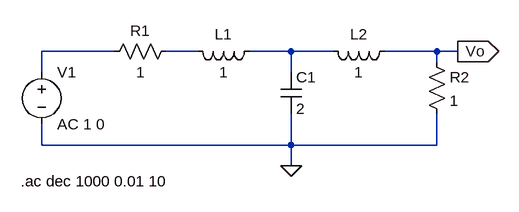
[diagram p0: schematic Ejercicio1.asc]
Ejercicio1.asc, the LTspice schematic file:
Version 4
SHEET 1 880 680
WIRE 16 112 -96 112
WIRE 144 112 96 112
WIRE 288 112 224 112
WIRE 352 112 288 112
WIRE 512 112 432 112
WIRE 544 112 512 112
WIRE 512 128 512 112
WIRE -96 144 -96 112
WIRE 288 144 288 112
WIRE -96 256 -96 224
WIRE 288 256 288 208
WIRE 288 256 -96 256
WIRE 512 256 512 208
WIRE 512 256 288 256
WIRE 288 288 288 256
FLAG 288 288 0
FLAG 544 112 Vo
IOPIN 544 112 Out
SYMBOL res 112 96 R90
WINDOW 0 0 56 VBottom 2
WINDOW 3 32 56 VTop 2
SYMATTR InstName R1
SYMATTR Value 1
SYMBOL ind 240 96 R90
WINDOW 0 5 56 VBottom 2
WINDOW 3 32 56 VTop 2
SYMATTR InstName L1
SYMATTR Value 1
SYMATTR SpiceLine Rser=0
SYMBOL cap 272 144 R0
SYMATTR InstName C1
SYMATTR Value 2
SYMATTR SpiceLine Rser=0
SYMBOL ind 448 96 R90
WINDOW 0 5 56 VBottom 2
WINDOW 3 32 56 VTop 2
SYMATTR InstName L2
SYMATTR Value 1
SYMATTR SpiceLine Rser=0
SYMBOL res 496 112 R0
SYMATTR InstName R2
SYMATTR Value 1
SYMBOL voltage -96 128 R0
SYMATTR InstName V1
SYMATTR Value AC 1 0
TEXT -128 312 Left 2 !.ac dec 1000 0.01 10

The netlist it stands for:
* Ejercicio1.asc
R1 N002 N001 1
L1 N003 N002 1 Rser=0
C1 N003 0 2 Rser=0
L2 Vo N003 1 Rser=0
R2 Vo 0 1
V1 N001 0 AC 1 0
.ac dec 1000 0.01 10
.backanno
.end